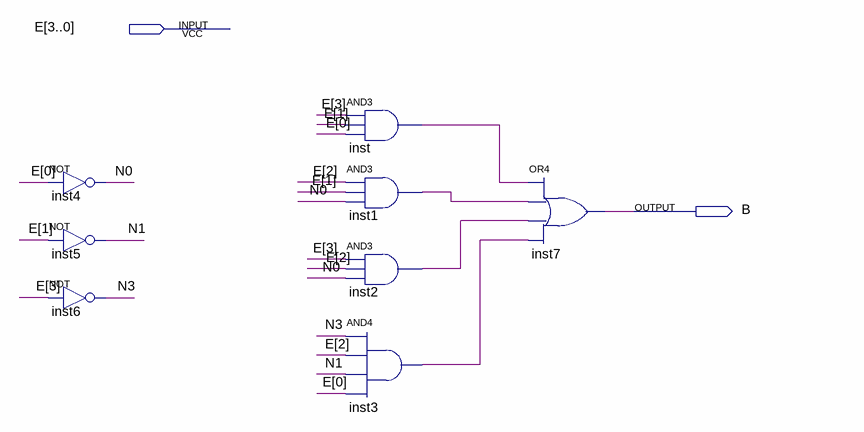
[diagram p0: schematic sheet]
// Quartus schematic B.bdf as structural Verilog: 8 symbols, 2 pins
module B (
  input  [3:0] E,
  output B
);

  wire inst1_out, inst2_out, inst3_out, inst_out, N0, N1, N3;

  not inst4 (N0, E[0]);
  not inst5 (N1, E[1]);
  not inst6 (N3, E[3]);
  and inst (inst_out, E[3], E[1], E[0]);
  and inst1 (inst1_out, E[2], E[1], N0);
  and inst2 (inst2_out, E[3], E[2], N0);
  and inst3 (inst3_out, N3, E[2], N1, E[0]);
  or inst7 (B, inst_out, inst1_out, inst2_out, inst3_out);
endmodule
